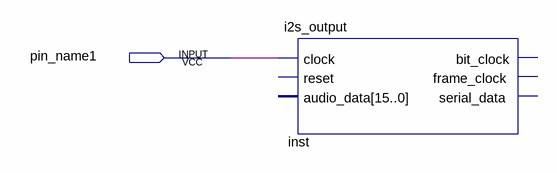
[diagram p0: schematic sheet]
// Quartus schematic I2S.bdf as structural Verilog: 1 symbols, 1 pins
module I2S (
  input  pin_name1
);

  i2s_output inst (.clock(pin_name1));  // open: reset, audio_data, bit_clock, frame_clock, serial_data
endmodule
